# EAGLE design cable_1 (EAGLE 9.5.2)
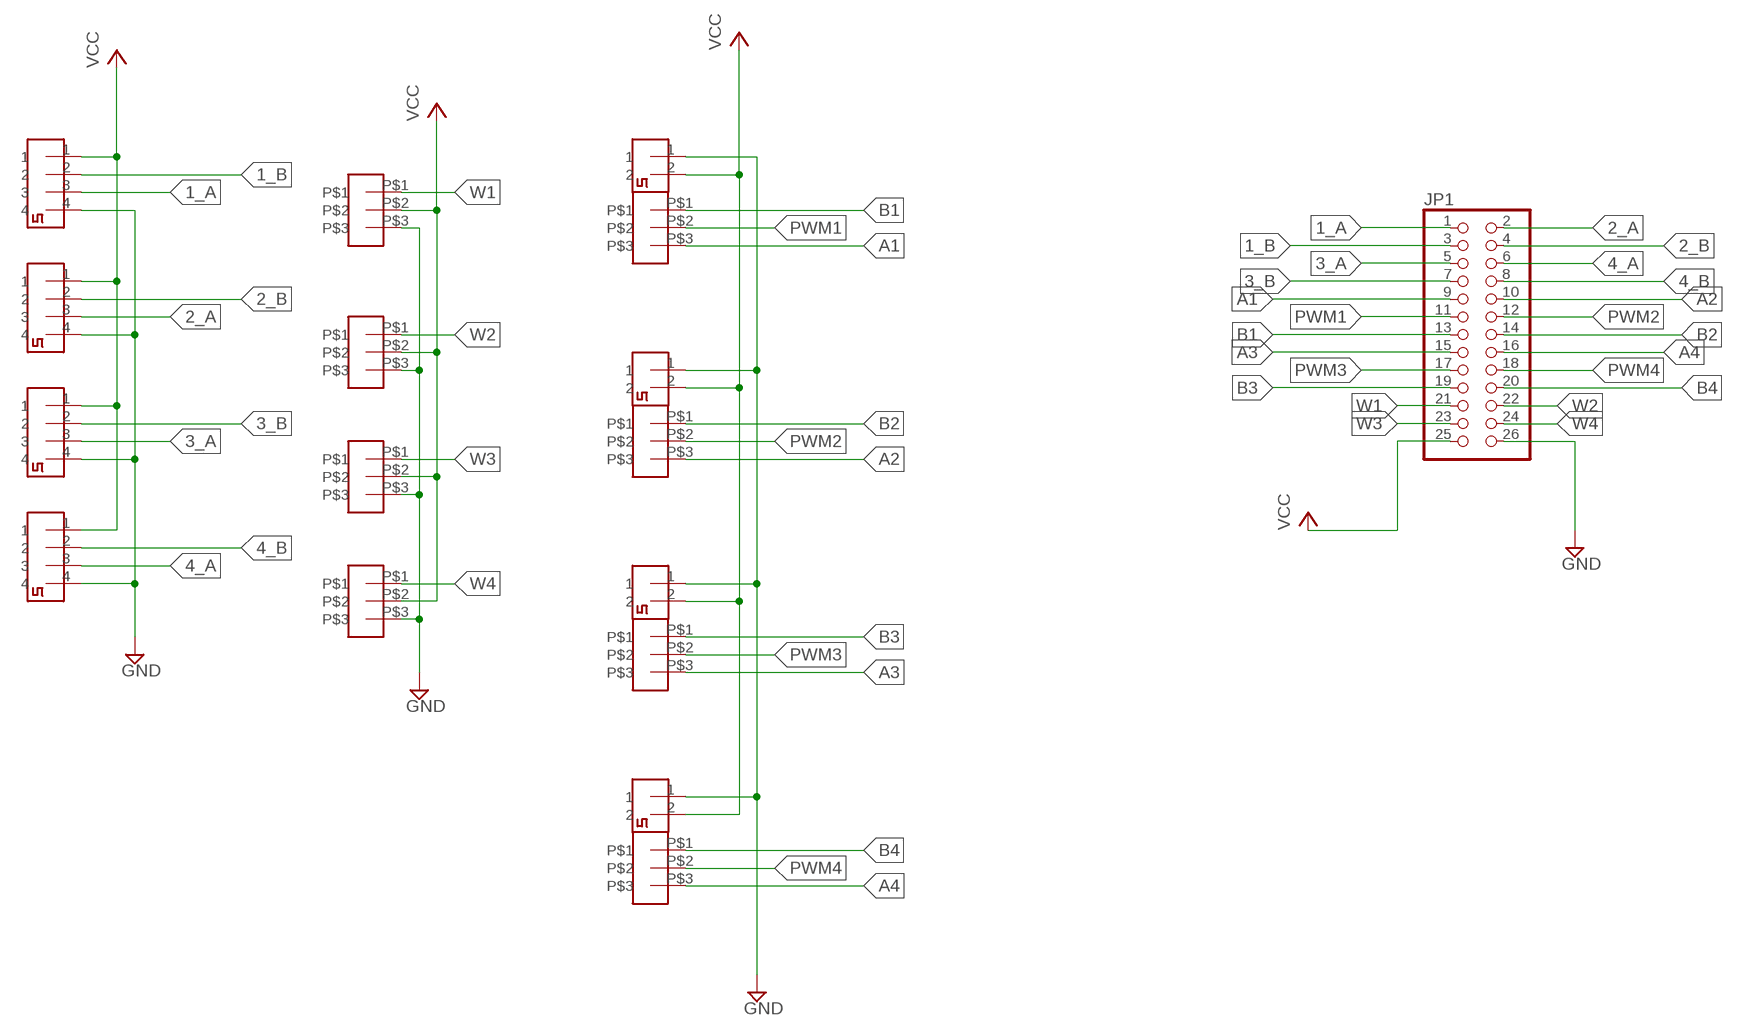
[diagram p0: schematic, sheet 1]

## Parts
3PIN1  3PIN  [3PIN]
3PIN2  3PIN  [3PIN]
3PIN3  3PIN  [3PIN]
3PIN4  3PIN  [3PIN]
3PIN5  3PIN  [3PIN]
3PIN6  3PIN  [3PIN]
3PIN7  3PIN  [3PIN]
3PIN8  3PIN  [3PIN]
CONNECTOR1  2PIN  [2PIN]
CONNECTOR2  2PIN  [2PIN]
CONNECTOR3  2PIN  [2PIN]
CONNECTOR4  2PIN  [2PIN]
CONNECTOR5  2PIN  [2PIN]
CONNECTOR6  2PIN  [2PIN]
CONNECTOR7  2PIN  [2PIN]
CONNECTOR8  2PIN  [2PIN]
JP1  PINHD-2X13  [2X13]

## Nets
1_A: CONNECTOR5.3 JP1.1
1_B: CONNECTOR5.2 JP1.3
2_A: CONNECTOR6.3 JP1.2
2_B: CONNECTOR6.2 JP1.4
3_A: CONNECTOR7.3 JP1.5
3_B: CONNECTOR7.2 JP1.7
4_A: CONNECTOR8.3 JP1.6
4_B: CONNECTOR8.2 JP1.8
A1: 3PIN5.P$3 JP1.9
A2: 3PIN6.P$3 JP1.10
A3: 3PIN7.P$3 JP1.15
A4: 3PIN8.P$3 JP1.16
B1: 3PIN5.P$1 JP1.13
B2: 3PIN6.P$1 JP1.14
B3: 3PIN7.P$1 JP1.19
B4: 3PIN8.P$1 JP1.20
GND: 3PIN1.P$3 3PIN2.P$3 3PIN3.P$3 3PIN4.P$3 CONNECTOR1.1 CONNECTOR2.1 CONNECTOR3.1 CONNECTOR4.1 CONNECTOR5.4 CONNECTOR6.4 CONNECTOR7.4 CONNECTOR8.4 JP1.26
PWM1: 3PIN5.P$2 JP1.11
PWM2: 3PIN6.P$2 JP1.12
PWM3: 3PIN7.P$2 JP1.17
PWM4: 3PIN8.P$2 JP1.18
VCC: 3PIN1.P$2 3PIN2.P$2 3PIN3.P$2 3PIN4.P$2 CONNECTOR1.2 CONNECTOR2.2 CONNECTOR3.2 CONNECTOR4.2 CONNECTOR5.1 CONNECTOR6.1 CONNECTOR7.1 CONNECTOR8.1 JP1.25
W1: 3PIN1.P$1 JP1.21
W2: 3PIN2.P$1 JP1.22
W3: 3PIN3.P$1 JP1.23
W4: 3PIN4.P$1 JP1.24

## Library data of the parts
3PIN1-3PIN8 = 3PIN_2:3PIN
CONNECTOR1-CONNECTOR4 = 2pin_small:2PIN: 2pin
CONNECTOR5-CONNECTOR8 = 4pin_small:2PIN: 2pin
JP1 = pinhead:PINHD-2X13: PIN HEADER

## Board
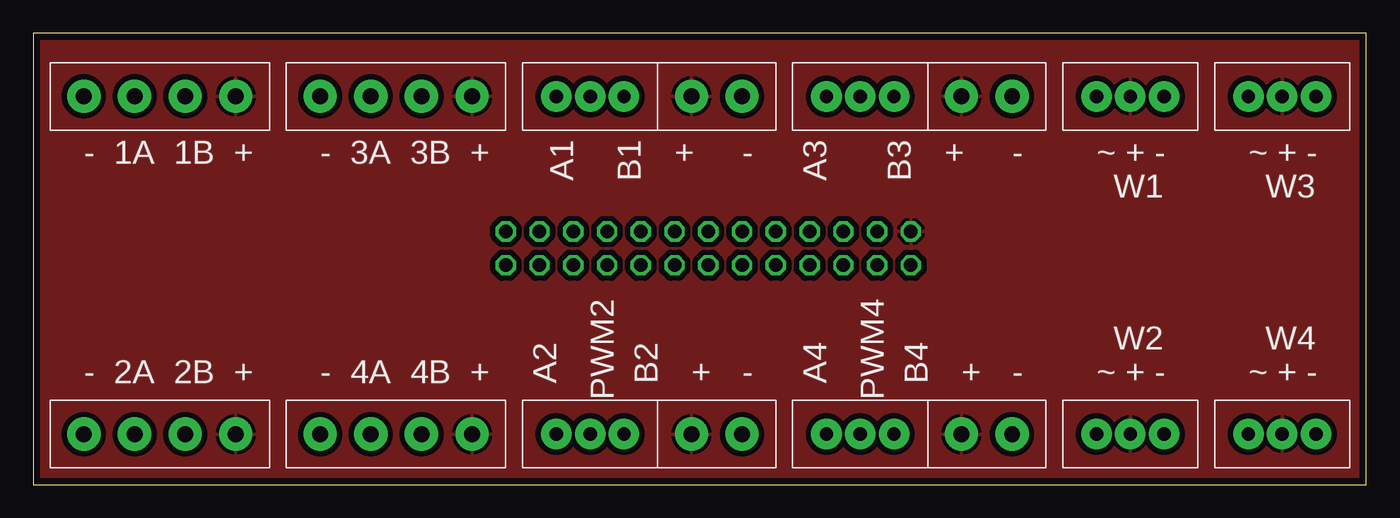
[diagram p1: board, top side]
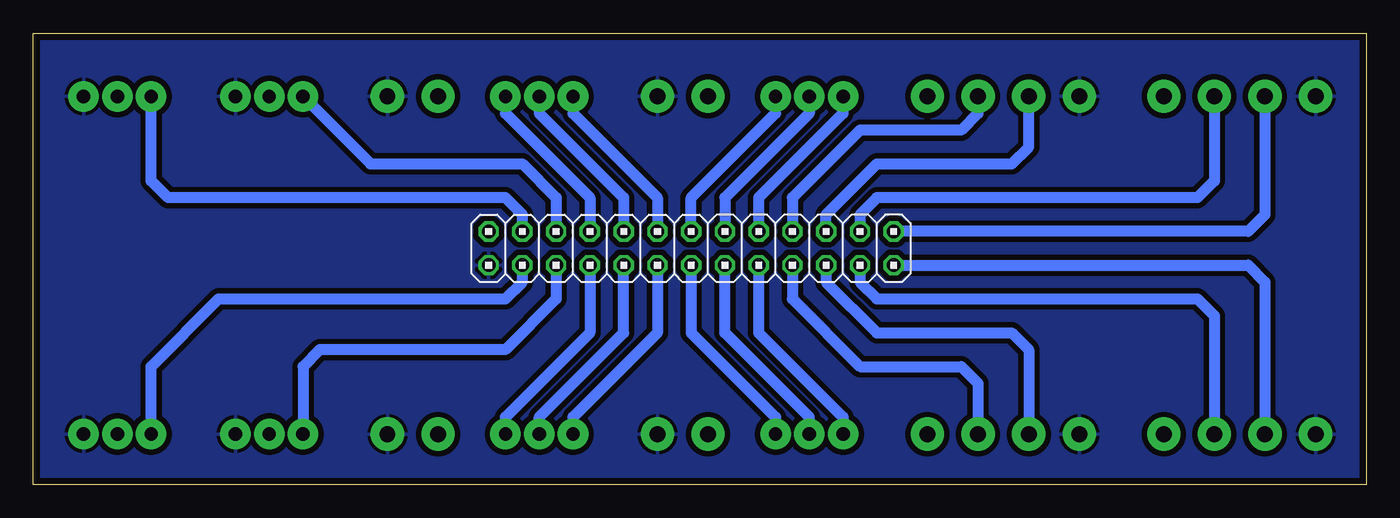
[diagram p2: board, bottom side, seen from below]

Size 100.31 x 33.96 mm. Coordinates in mm from the lower left corner, seen from the top.
Outline: 0,0 100.31,0 100.31,33.96 0,33.96 0,0
Copper layers (1*16): Top 0.035mm / dielectric 1.6mm / Bottom 0.035mm
Design rules "Elecrow_2-layer_PCB_eagle_rule": minimum track width 6mil, minimum drill 12mil, track to track 6mil, track to pad 6mil, pad to pad 6mil, via to via 8mil, smd to smd 0mil, copper to edge 20mil, drill to drill 10mil, minimum pad ring 6mil, minimum via ring 6mil, stop-mask expansion 0mil, vias tented up to drill 100mil, thermal gap 10mil

### Footprints (pad centres in the part's own frame; a part is rotated, then mirrored left to right if it is on the bottom)
3PIN = drill 1 pad 2.3: P$1 0,0; P$2 2.54,0; P$3 5.08,0
2PIN = drill 1.2 pad 2.5: 1 0,0; 2 3.81,0
2PIN' = drill 1.2 pad 2.5: 1 0,0; 2 3.81,0; 3 7.62,0; 4 11.43,0
2X13 = drill 1.016 octagon: 1 -15.24,-1.27; 2 -15.24,1.27; 3 -12.7,-1.27; 4 -12.7,1.27; 5 -10.16,-1.27; 6 -10.16,1.27; 7 -7.62,-1.27; 8 -7.62,1.27; 9 -5.08,-1.27; 10 -5.08,1.27; 11 -2.54,-1.27; 12 -2.54,1.27; 13 0,-1.27; 14 0,1.27; 15 2.54,-1.27; 16 2.54,1.27; 17 5.08,-1.27; 18 5.08,1.27; 19 7.62,-1.27; 20 7.62,1.27; 21 10.16,-1.27; 22 10.16,1.27; 23 12.7,-1.27; 24 12.7,1.27; 25 15.24,-1.27; 26 15.24,1.27

### Placement (x,y rotation side)
3PIN1  80.01,29.21 0 top
3PIN2  80.01,3.81 0 top
3PIN3  91.44,29.21 0 top
3PIN4  91.44,3.81 0 top
3PIN5  44.45,29.21 180 top
3PIN6  44.45,3.81 180 top
3PIN7  64.77,29.21 180 top
3PIN8  64.77,3.81 180 top
CONNECTOR1  73.66,29.21 180 top
CONNECTOR2  73.66,3.81 180 top
CONNECTOR3  53.34,29.21 180 top
CONNECTOR4  53.34,3.81 180 top
CONNECTOR5  2PIN  [2PIN']  15.24,29.21 180 top
CONNECTOR6  2PIN  [2PIN']  15.24,3.81 180 top
CONNECTOR7  2PIN  [2PIN']  33.02,29.21 180 top
CONNECTOR8  2PIN  [2PIN']  33.02,3.81 180 top
JP1  50.8,17.78 180 bottom

### Tracks (layer width: path | path; a pad name or v marks a point on that pad's centre or on a via)
1_A
  Bottom 0.813: JP1.1 8.89,19.05 7.62,20.32 CONNECTOR5.3
1_B
  Bottom 0.813: CONNECTOR5.2 11.43,22.86 12.7,21.59 36.83,21.59 38.1,20.32 JP1.3
2_A
  Bottom 0.813: JP1.2 8.89,16.51 7.62,15.24 CONNECTOR6.3
2_B
  Bottom 0.813: JP1.4 38.1,15.24 36.83,13.97 12.7,13.97 11.43,12.7 CONNECTOR6.2
3_A
  Bottom 0.813: JP1.5 40.64,20.32 36.83,24.13 26.67,24.13 25.4,25.4 CONNECTOR7.3
3_B
  Bottom 0.813: CONNECTOR7.2 29.21,27.94 30.48,26.67 38.1,26.67 43.18,21.59 JP1.7
4_A
  Bottom 0.813: JP1.6 40.64,15.24 36.83,11.43 26.67,11.43 25.4,10.16 CONNECTOR8.3
4_B
  Bottom 0.813: JP1.8 43.18,13.97 38.1,8.89 30.48,8.89 29.21,7.62 CONNECTOR8.2
A1
  Bottom 0.813: 3PIN5.P$3 39.37,27.94 45.72,21.59 JP1.9
A2
  Bottom 0.813: 3PIN6.P$3 39.37,5.08 45.72,11.43 JP1.10
A3
  Bottom 0.813: 3PIN7.P$3 59.69,27.94 53.34,21.59 JP1.15
A4
  Bottom 0.813: 3PIN8.P$3 59.69,5.08 53.34,11.43 JP1.16
B1
  Bottom 0.813: JP1.13 50.8,21.59 44.45,27.94 3PIN5.P$1
B2
  Bottom 0.813: JP1.14 50.8,11.43 44.45,5.08 3PIN6.P$1
B3
  Bottom 0.813: 3PIN7.P$1 64.77,27.94 58.42,21.59 JP1.19
B4
  Bottom 0.813: JP1.20 58.42,11.43 64.77,5.08 3PIN8.P$1
GND
  pour Bottom (isolate 0.406): 0,34.29 0,0 100.33,0 100.33,34.29
PWM1
  Bottom 0.813: 3PIN5.P$2 41.91,27.94 48.26,21.59 JP1.11
PWM2
  Bottom 0.813: 3PIN6.P$2 41.91,5.08 48.26,11.43 JP1.12
PWM3
  Bottom 0.813: JP1.17 55.88,21.59 62.23,27.94 3PIN7.P$2
PWM4
  Bottom 0.813: 3PIN8.P$2 62.23,5.08 55.88,11.43 JP1.18
VCC
  pour Top (isolate 0.406): 0,34.29 0,0 100.33,0 100.33,34.29
W1
  Bottom 0.813: 3PIN1.P$1 74.93,24.13 63.5,24.13 60.96,21.59 JP1.21
W2
  Bottom 0.813: JP1.22 60.96,13.97 64.77,10.16 78.74,10.16 80.01,8.89 3PIN2.P$1
W3
  Bottom 0.813: JP1.23 63.5,20.32 64.77,21.59 90.17,21.59 91.44,22.86 3PIN3.P$1
W4
  Bottom 0.813: 3PIN4.P$1 91.44,8.89 86.36,13.97 64.77,13.97 63.5,15.24 JP1.24

### Text on the board
tNames: - 1A 1B + | - 3A 3B + | + | - | + | - | ~ + - | ~ + - | A1 | B1 | A3 | B3 | W1 | W3 | PWM2 | PWM4 | W2 | W4 | - 2A 2B + | - 4A 4B + | A2 | B2 | + | - | A4 | B4 | + | - | ~ + - | ~ + -